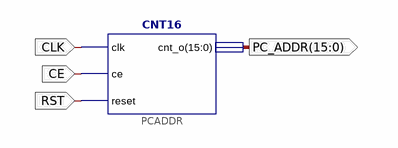
[diagram p0: schematic sheet 1]
// Xilinx ISE schematic PC.sch (spartan6) as structural Verilog: 1 symbols, 4 ports
module PC (
  input  CLK,
  input  CE,
  input  RST,
  output [15:0] PC_ADDR
);

  CNT16 PCADDR (.clk(CLK), .ce(CE), .reset(RST), .cnt_o(PC_ADDR));
endmodule
